# Altium schematic sheet General.SchDoc
size A3
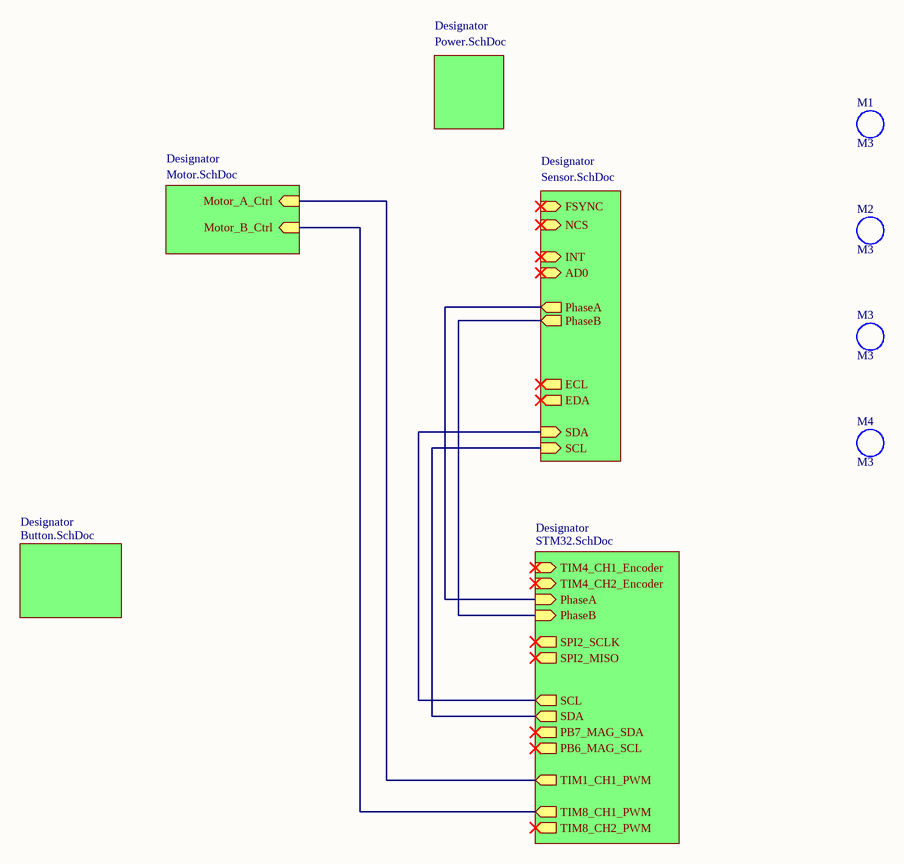
[diagram p0: General.SchDoc]

## Parts
M1  M3  [M3 140X350]
M2  M3  [M3 140X350]
M3  M3  [M3 140X350]
M4  M3  [M3 140X350]

## Sub-sheets
Designator = Motor.SchDoc: Motor_A_Ctrl (in), Motor_B_Ctrl (in)
Designator = Power.SchDoc: no entries
Designator = Sensor.SchDoc: FSYNC (in), NCS (in), INT (in), AD0 (in), ECL (out), EDA (out), SDA (in), SCL (in), PhaseB (out), PhaseA (out)
Designator = STM32.SchDoc: SPI2_SCLK (out), TIM1_CH1_PWM (out), PB6_MAG_SCL (out), PB7_MAG_SDA (out), SPI2_MISO (out), TIM4_CH1_Encoder (in), TIM8_CH1_PWM (out), TIM4_CH2_Encoder (in), TIM8_CH2_PWM (out), PhaseA (in), PhaseB (in), SCL (out), SDA (out)
Designator = Button.SchDoc: no entries

## Nets
(unnamed): sheet Designator/Motor_A_Ctrl, sheet Designator/TIM1_CH1_PWM
(unnamed): sheet Designator/Motor_B_Ctrl, sheet Designator/TIM8_CH1_PWM
(unnamed): sheet Designator/SDA, sheet Designator/SCL
(unnamed): sheet Designator/SCL, sheet Designator/SDA
(unnamed): sheet Designator/PhaseB, sheet Designator/PhaseB
(unnamed): sheet Designator/PhaseA, sheet Designator/PhaseA

## Library data of the parts
M1-M4 = M3: 铜柱孔; 版权归属: 源创客; BOM名称: 铜柱孔; 学习资源: www.ooocke.com